# Altium schematic sheet Sheet1.SchDoc
size A4
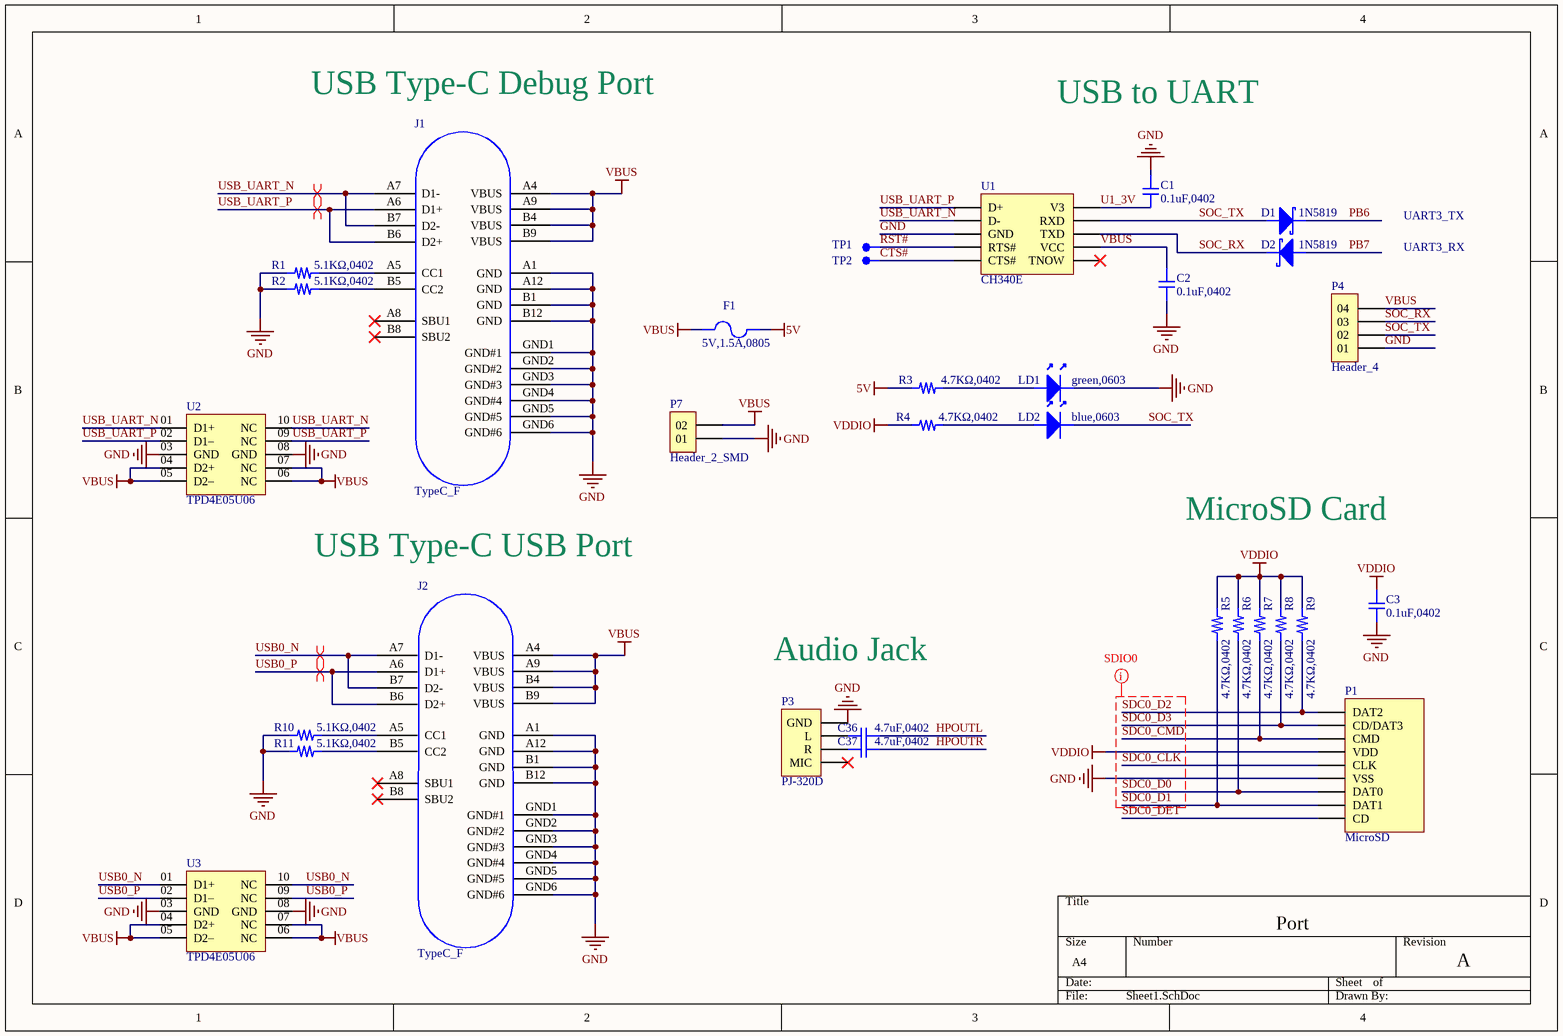
[diagram p0: Sheet1.SchDoc]

## Parts
C1  0.1uF,0402  [C0402]
C2  0.1uF,0402  [C0402]
C3  0.1uF,0402  [C0402]
C36  4.7uF,0402  [C0402]
C37  4.7uF,0402  [C0402]
D1  1N5819  [SOD-323]
D2  1N5819  [SOD-323]
F1  5V,1.5A,0805  [F0805]
J1  TypeC_F  [Type-C_16P_F_0.5_DIP]
J2  TypeC_F  [Type-C_16P_F_0.5_DIP]
LD1  green,0603  [LED0603]
LD2  blue,0603  [LED0603]
P1  MicroSD  [MicroSD]
P3  PJ-320D  [PJ-320D]
P4  Header_4  [HEADER_4_SMD]
P7  Header_2_SMD  [HEADER_2_SMD]
R1  5.1KΩ,0402  [R0402]
R2  5.1KΩ,0402  [R0402]
R3  4.7KΩ,0402  [R0402]
R4  4.7KΩ,0402  [R0402]
R5  4.7KΩ,0402  [R0402]
R6  4.7KΩ,0402  [R0402]
R7  4.7KΩ,0402  [R0402]
R8  4.7KΩ,0402  [R0402]
R9  4.7KΩ,0402  [R0402]
R10  5.1KΩ,0402  [R0402]
R11  5.1KΩ,0402  [R0402]
TP1  TP  [TP]  (value not drawn)
TP2  TP  [TP]  (value not drawn)
U1  CH340E  [MSOP-10]
U2  TPD4E05U06  [USON-10]
U3  TPD4E05U06  [USON-10]

## Nets
5V: F1.02 R3.01
GND: C1.02 C2.01 C3.01 J1.A1(GND) J1.A12(GND) J1.B1(GND) J1.B12(GND) J1.GND1(GND#1) J1.GND2(GND#2) J1.GND3(GND#3) J1.GND4(GND#4) J1.GND5(GND#5) J1.GND6(GND#6) J2.A1(GND) J2.A12(GND) J2.B1(GND) J2.B12(GND) J2.GND1(GND#1) J2.GND2(GND#2) J2.GND3(GND#3) J2.GND4(GND#4) J2.GND5(GND#5) J2.GND6(GND#6) LD1.02 P1.06(VSS) P3.01(GND) P4.01 P7.01 R1.01 R2.01 R10.01 R11.01 U1.03(GND) U2.03(GND) U2.08(GND) U3.03(GND) U3.08(GND)
VBUS: C2.02 F1.01 J1.A4(VBUS) J1.A9(VBUS) J1.B4(VBUS) J1.B9(VBUS) J2.A4(VBUS) J2.A9(VBUS) J2.B4(VBUS) J2.B9(VBUS) P4.04 P7.02 U1.07(VCC) U2.04(D2+) U2.05(D2–) U2.06(NC) U2.07(NC) U3.04(D2+) U3.05(D2–) U3.06(NC) U3.07(NC)
VDDIO: C3.02 P1.04(VDD) R4.01 R5.02 R6.02 R7.02 R8.02 R9.02
CTS#: TP2.01 U1.05(CTS#)
HPOUTL: C36.01
HPOUTR: C37.01
PB6: D1.02
PB7: D2.01
RST#: TP1.01 U1.04(RTS#)
SDC0_CLK: P1.05(CLK)
SDC0_CMD: P1.03(CMD) R7.01
SDC0_D0: P1.07(DAT0) R6.01
SDC0_D1: P1.08(DAT1) R5.01
SDC0_D2: P1.01(DAT2) R9.01
SDC0_D3: P1.02(CD/DAT3) R8.01
SDC0_DET: P1.09(CD)
SOC_RX: D2.02 P4.03 U1.08(TXD)
SOC_TX: D1.01 LD2.02 P4.02 U1.09(RXD)
U1_3V: C1.01 U1.10(V3)
USB0_N: J2.A7(D1-) J2.B7(D2-) U3.01(D1+) U3.10(NC)
USB0_P: J2.A6(D1+) J2.B6(D2+) U3.02(D1–) U3.09(NC)
USB_UART_N: J1.A7(D1-) J1.B7(D2-) U1.02(D-) U2.01(D1+) U2.10(NC)
USB_UART_P: J1.A6(D1+) J1.B6(D2+) U1.01(D+) U2.02(D1–) U2.09(NC)
NetC36_02: C36.02 P3.04(L)
NetC37_02: C37.02 P3.03(R)
NetJ1_A5: J1.A5(CC1) R1.02
NetJ1_B5: J1.B5(CC2) R2.02
NetJ2_A5: J2.A5(CC1) R10.02
NetJ2_B5: J2.B5(CC2) R11.02
NetLD1_01: LD1.01 R3.02
NetLD2_01: LD2.01 R4.02

Not connected (* = marked no-connect by the designer): J1 A8(SBU1)* B8(SBU2)*; J2 A8(SBU1)* B8(SBU2)*; P3 02(MIC)*; U1 06(TNOW)*

## Layout directives
differential pair: USB0_N, USB0_P, USB_UART_N, USB_UART_P
net class SDIO0: SDC0_CLK, SDC0_CMD, SDC0_D0, SDC0_D1, SDC0_D2, SDC0_D3

## Notes on the sheet
- USB Type-C Debug Port
- USB to UART
- UART3_TX
- UART3_RX
- USB Type-C USB Port
- MicroSD Card
- Audio Jack
- Port
- A

## Library data of the parts
C1-C3 C36 C37 = Cap
D1 D2 = Diode - Schottky
F1 = Fuse
J1 J2 = Type-C_16P_F_0.5: Female SMD Connector
LD1 LD2 = Diode - LED
P3 = PJ-320D: Audio jack
P7 = Header_2
R1-R11 = Res